# EAGLE design ValetudoV2 (EAGLE 9.6.2)
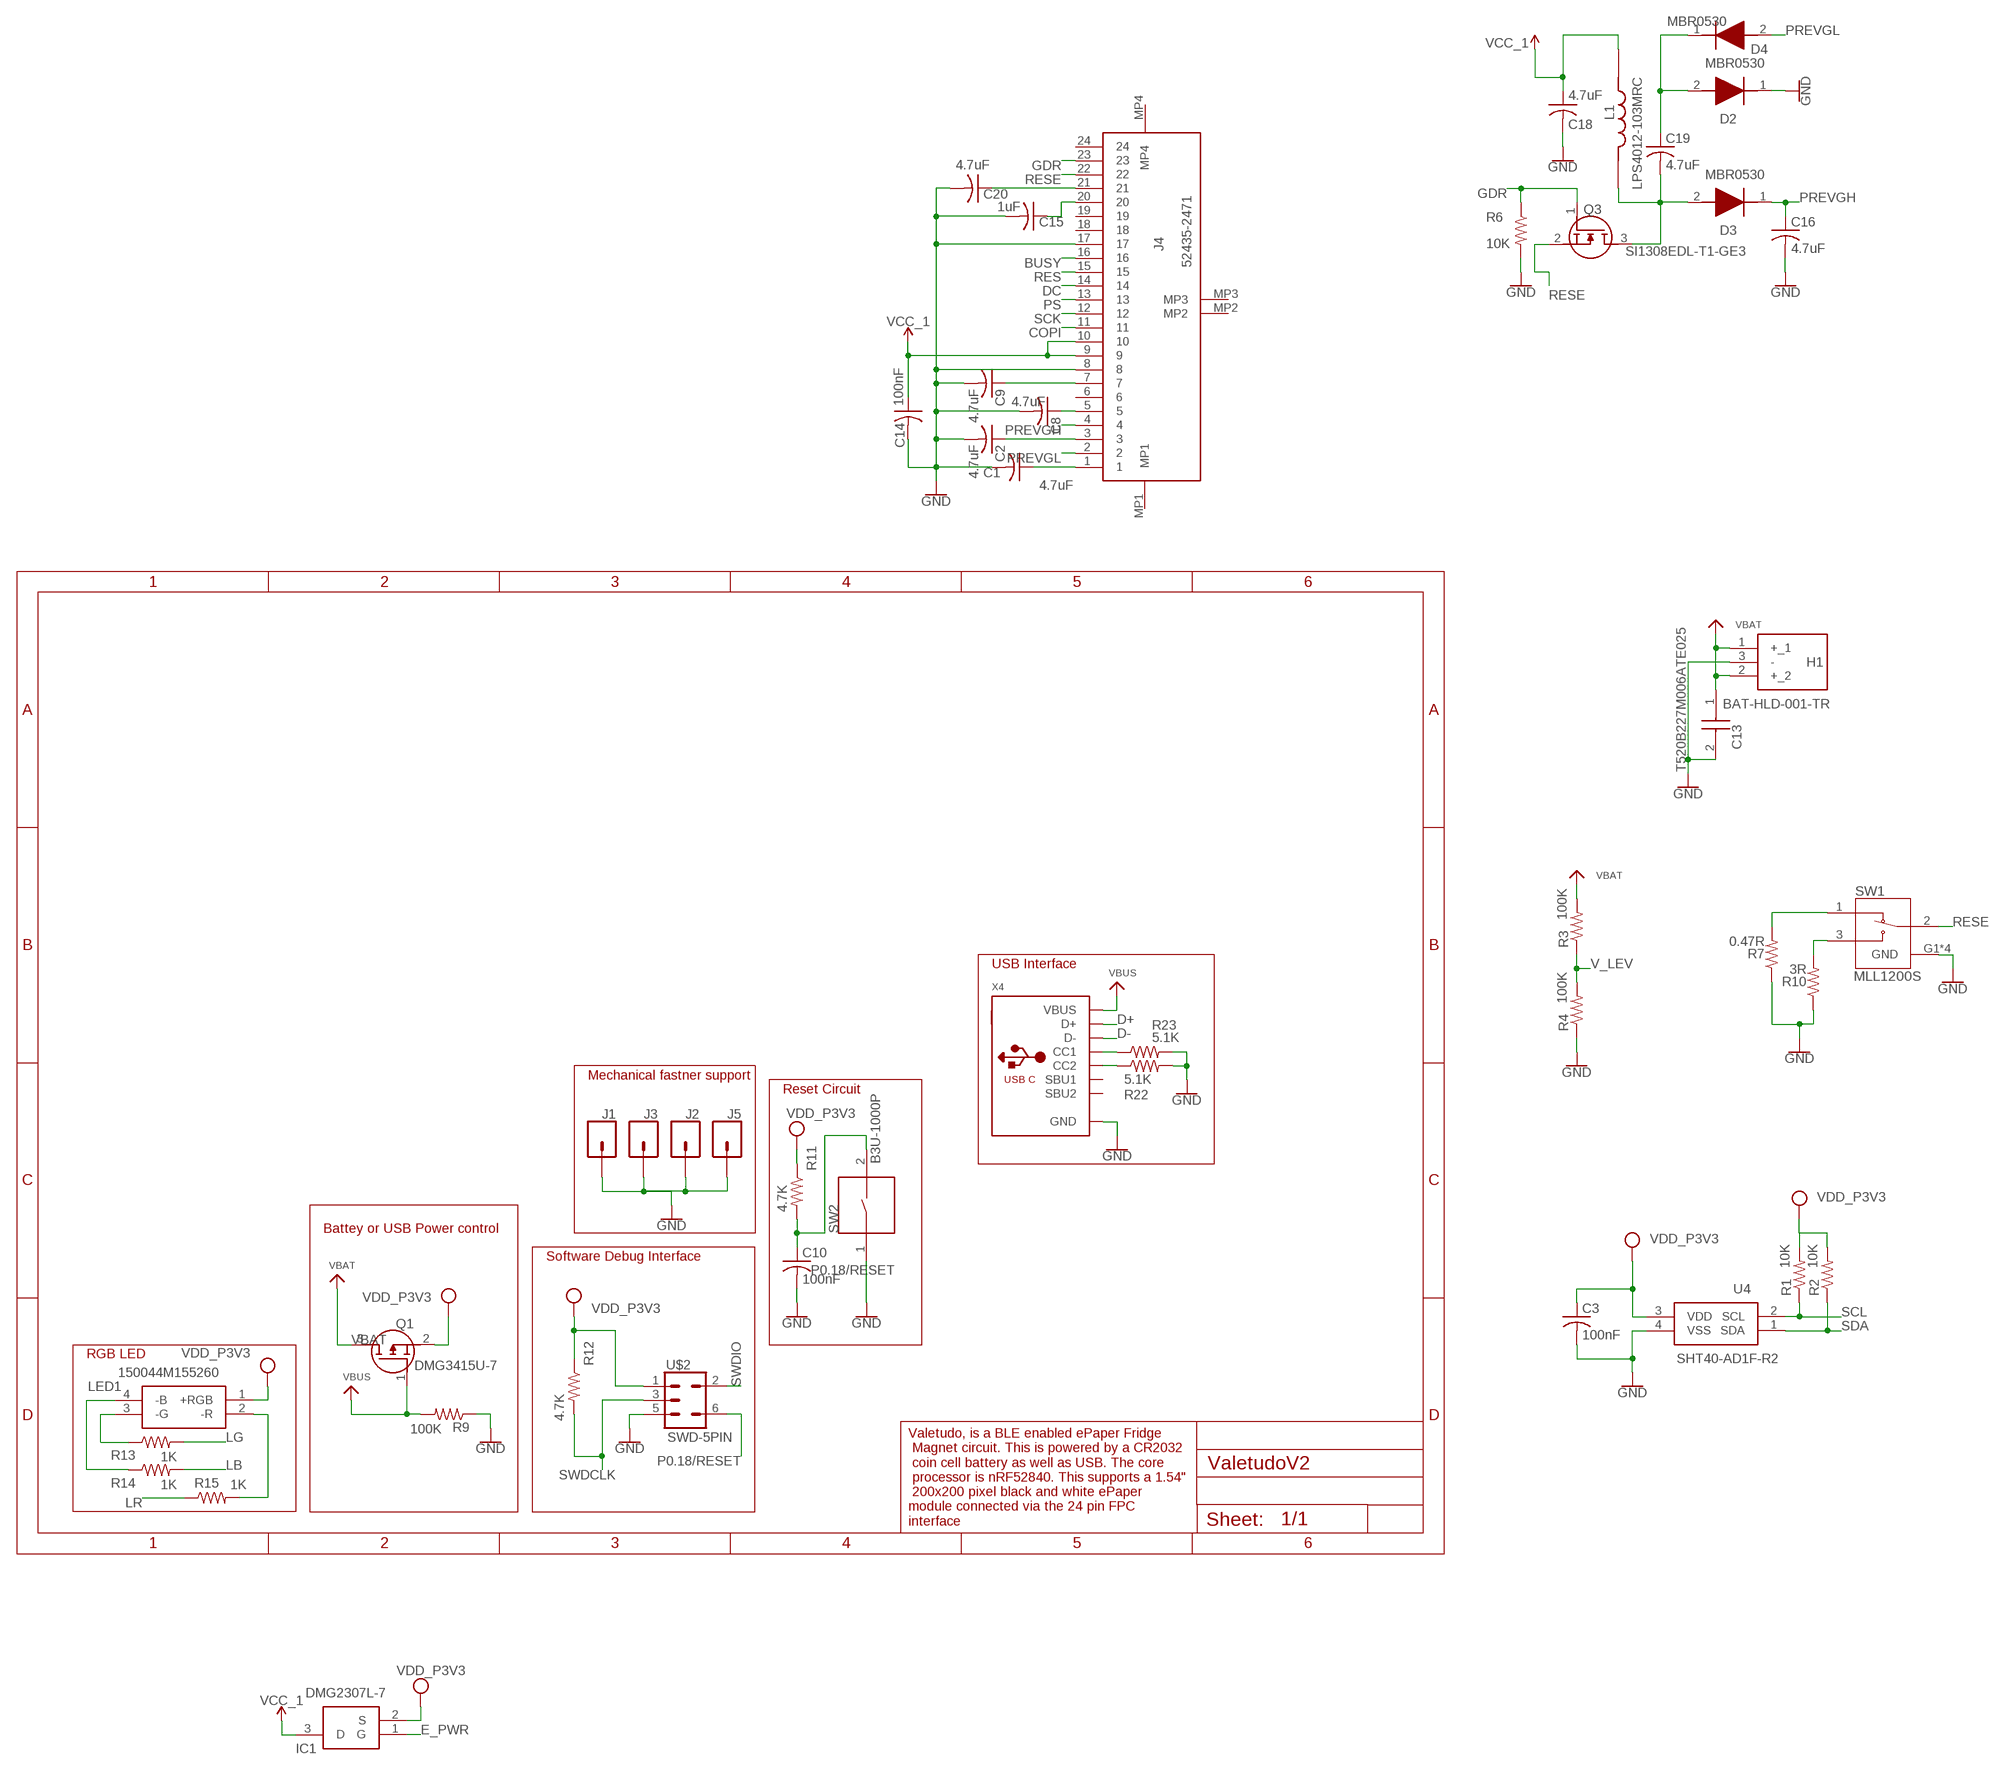
[diagram p0: schematic, sheet 1, part 1 of 2]
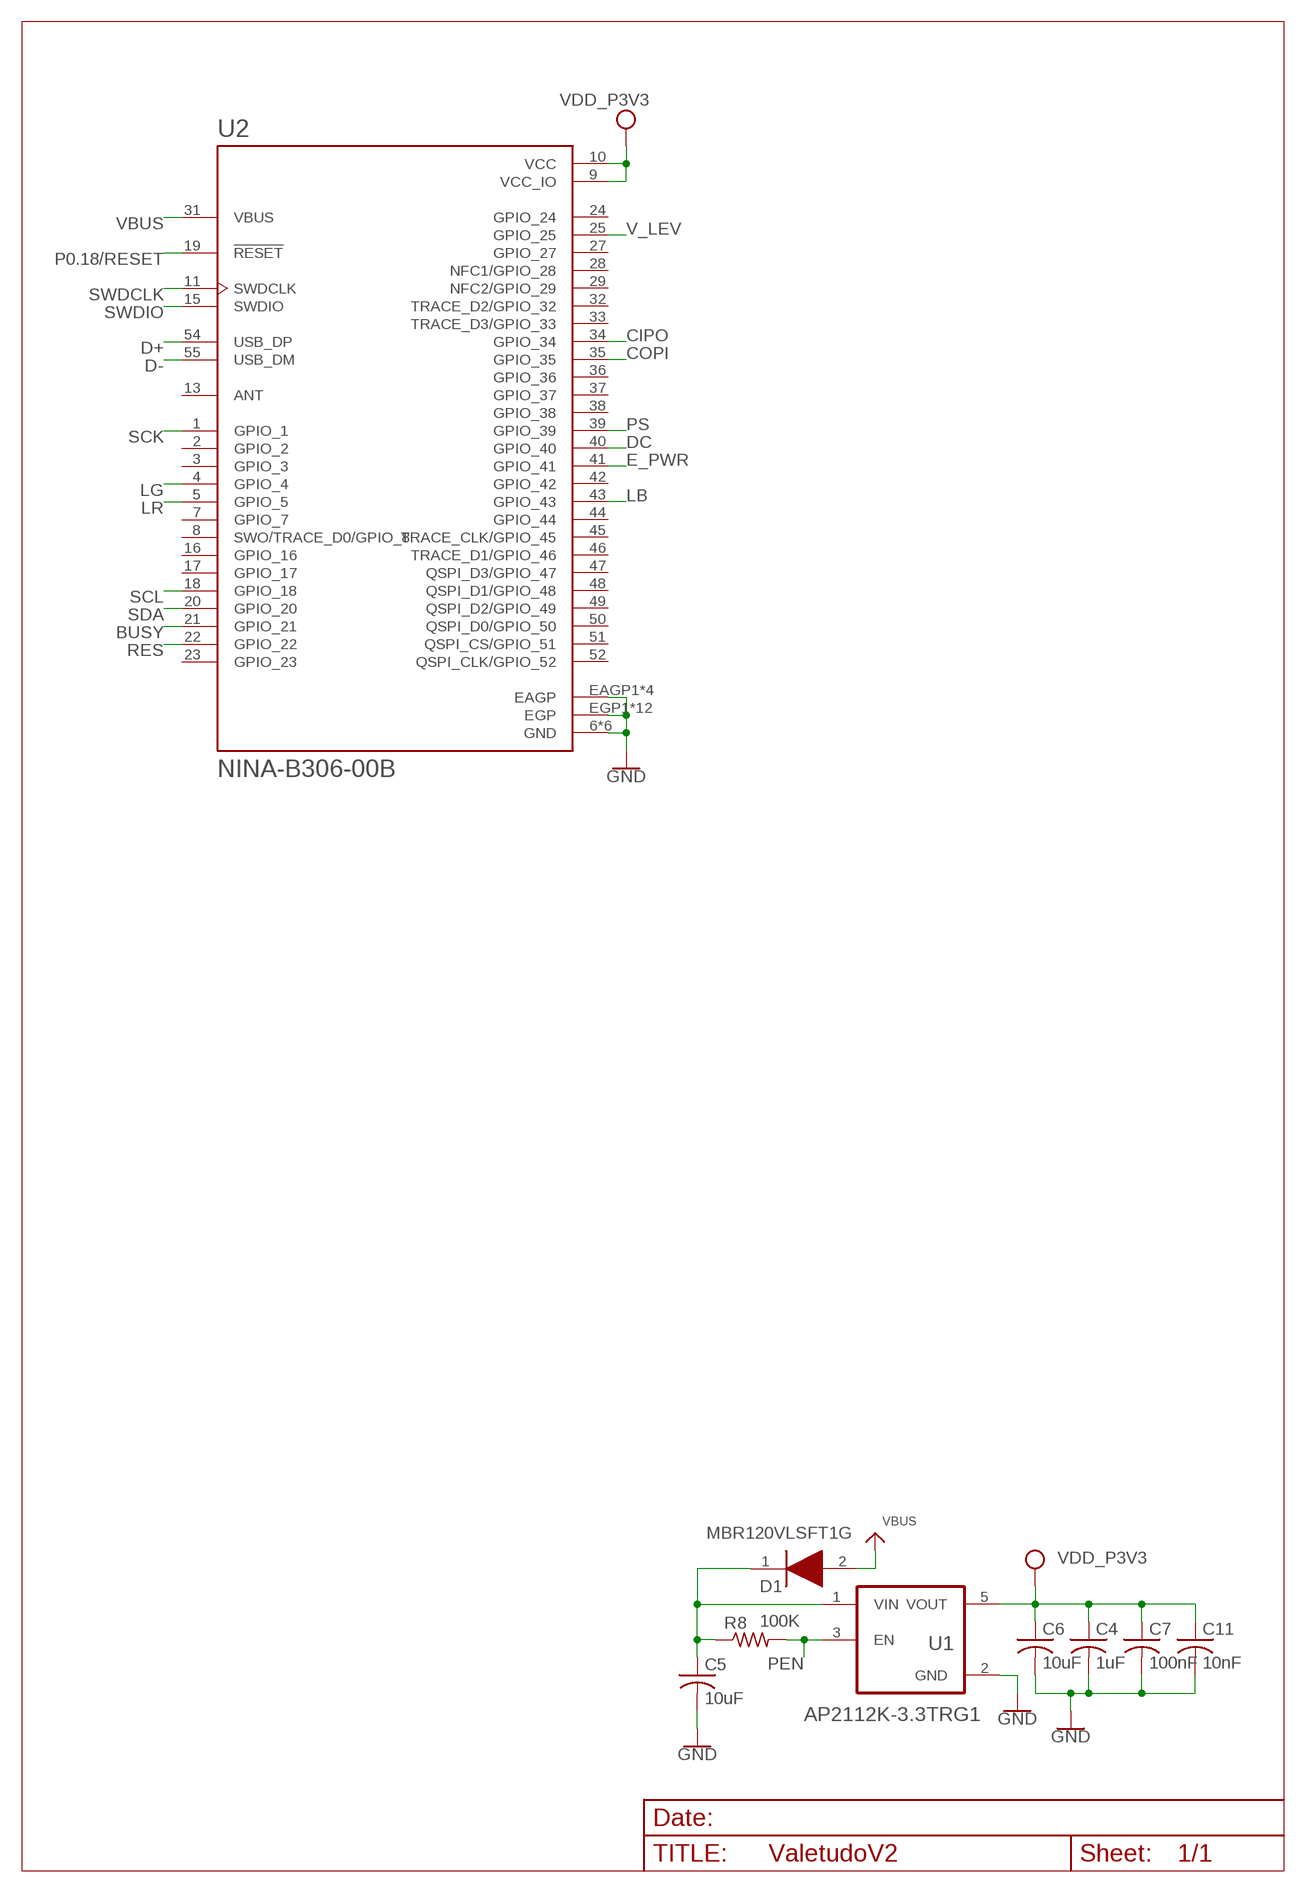
[diagram p1: schematic, sheet 1, part 2 of 2]

## Parts
C1  4.7uF  C-USC0402  [C0402]
C2  4.7uF  C-USC0402  [C0402]
C3  100nF  C-USC0402  [C0402]
C4  1uF  C-USC0402  [C0402]
C5  10uF  C-USC0402  [C0402]
C6  10uF  C-USC0402  [C0402]
C7  100nF  C-USC0402  [C0402]
C8  4.7uF  C-USC0402  [C0402]
C9  4.7uF  C-USC0402  [C0402]
C10  100nF  C-USC0402  [C0402]
C11  10nF  C-USC0402  [C0402]
C13  T520B227M006ATE025  [T520B]
C14  100nF  C-USC0402  [C0402]
C15  1uF  C-USC0402  [C0402]
C16  4.7uF  C-USC0402  [C0402]
C18  4.7uF  C-USC0402  [C0402]
C19  4.7uF  C-USC0402  [C0402]
C20  4.7uF  C-USC0402  [C0402]
D1  MBR120VLSFT1G  [SODFL3616X98N]
D2  MBR0530  [SOD3716X135N]
D3  MBR0530  [SOD3716X135N]
D4  MBR0530  [SOD3716X135N]
H1  BAT-HLD-001-TR  [BATHLD001TR]
IC1  DMG2307L-7  [SOT96P240X110-3N]
J1  CONN_01PTH_2MM  [1X01_2MM]
J2  CONN_01PTH_2MM  [1X01_2MM]
J3  CONN_01PTH_2MM  [1X01_2MM]
J4  52435-2471  [524352471]
J5  CONN_01PTH_2MM  [1X01_2MM]
L1  LPS4012-103MRC  [IND_LPS4012-103MRC]
LED1  150044M155260  [150044M155260]
Q1  DMG3415U-7  [SOT96P240X100-3N]
Q3  SI1308EDL-T1-GE3  [SOT65P210X110-3N]
R1  10K  R-US_R0402  [R0402]
R2  10K  R-US_R0402  [R0402]
R3  100K  R-US_R0402  [R0402]
R4  100K  R-US_R0402  [R0402]
R6  10K  R-US_R0402  [R0402]
R7  0.47R  R-US_R0402  [R0402]
R8  100K  R-US_R0402  [R0402]
R9  100K  R-US_R0402  [R0402]
R10  3R  R-US_R0402  [R0402]
R11  4.7K  R-US_R0402  [R0402]
R12  4.7K  R-US_R0402  [R0402]
R13  1K  R-US_R0402  [R0402]
R14  1K  R-US_R0402  [R0402]
R15  1K  R-US_R0402  [R0402]
R22  5.1K  R-US_R0402  [R0402]
R23  5.1K  R-US_R0402  [R0402]
SW1  MLL1200S  [SW_MLL1200S]
SW2  B3U-1000P  [SW_B3U-1000P]
U1  AP2112K-3.3TRG1  [SOT95P285X140-5N]
U2  NINA-B306-00B  [XCVR_NINA-B306-00B]
U4  SHT40-AD1F-R2  [SHT40AD1FR2]
U$2  SWD-5PIN  [PAD_05_03X2_TP_NO4]
X4  MICROBUILDER_USB_C  [MICROBUILDER_USB_C_CUSB31-CFM2AX-01-X]

## Nets
BUSY: J4.16 U2.21(GPIO_21)
CIPO: U2.34(GPIO_34)
COPI: J4.11 U2.35(GPIO_35)
D+: U2.54(USB_DP) X4.A6(D+) X4.B6(D+)
D-: U2.55(USB_DM) X4.A7(D-) X4.B7(D-)
DC: J4.14 U2.40(GPIO_40)
E_PWR: IC1.1(G) U2.41(GPIO_41)
GDR: J4.23 Q3.1(G) R6.1
GND: C1.2 C2.2 C3.2 C4.2 C5.2 C6.2 C7.2 C8.2 C9.2 C10.2 C11.2 C13.2(-) C14.2 C15.2 C16.2 C18.2 C20.2 D2.1(K) H1.3(-) J1.1 J2.1 J3.1 J4.8 J4.17 J5.1 R4.1 R6.2 R7.1 R9.1 R10.1 R22.2 R23.2 SW1.G1(GND) SW1.G2(GND) SW1.G3(GND) SW1.G4(GND) SW2.1 U1.2(GND) U2.6(GND) U2.12(GND) U2.14(GND) U2.26(GND) U2.30(GND) U2.53(GND) U2.EAGP1(EAGP) U2.EAGP2(EAGP) U2.EAGP3(EAGP) U2.EAGP4(EAGP) U2.EGP1(EGP) U2.EGP2(EGP) U2.EGP3(EGP) U2.EGP4(EGP) U2.EGP5(EGP) U2.EGP6(EGP) U2.EGP7(EGP) U2.EGP8(EGP) U2.EGP9(EGP) U2.EGP10(EGP) U2.EGP11(EGP) U2.EGP12(EGP) U4.4(VSS) U$2.5 X4.A1B12(GND) X4.B1A12(GND)
LB: R14.2 U2.43(GPIO_43)
LG: R13.2 U2.4(GPIO_4)
LR: R15.1 U2.5(GPIO_5)
N$1: LED1.4(-B) R14.1
N$2: LED1.3(-G) R13.1
N$3: LED1.2(-R) R15.2
N$4: R7.2 SW1.1
N$5: C1.1 J4.1
N$6: C19.1 D2.2(A) D4.1(K)
N$7: R22.1 X4.B5(CC2)
N$8: C2.1 J4.3
N$9: R23.1 X4.A5(CC1)
N$10: C5.1 D1.1(K) R8.1 U1.1(VIN)
N$11: C19.2 D3.2(A) L1.2 Q3.3(D)
N$12: C8.1 J4.5
N$13: R10.2 SW1.3
N$14: C9.1 J4.7
N$15: C15.1 J4.20
N$29: C20.1 J4.21
P0.18/RESET: C10.1 R11.2 SW2.2 U2.19(!RESET) U$2.6
PEN: R8.2 U1.3(EN)
PREVGH: C16.1 D3.1(K) J4.4
PREVGL: D4.2(A) J4.2
PS: J4.13 U2.39(GPIO_39)
RES: J4.15 U2.22(GPIO_22)
RESE: J4.22 Q3.2(S) SW1.2
SCK: J4.12 U2.1(GPIO_1)
SCL: R1.1 U2.18(GPIO_18) U4.2(SCL)
SDA: R2.1 U2.20(GPIO_20) U4.1(SDA)
SWDCLK: R12.2 U2.11(SWDCLK) U$2.3
SWDIO: U2.15(SWDIO) U$2.2
V_LEV: R3.1 R4.2 U2.25(GPIO_25)
VBAT: C13.1(+) H1.1(+_1) H1.2(+_2) Q1.3(D) R3.2
VBUS: D1.2(A) Q1.1(G) R9.2 U2.31(VBUS) X4.A4B9(VBUS) X4.B4A9(VBUS)
VCC: C3.1 C4.1 C6.1 C7.1 C11.1 IC1.2(S) LED1.1(+RGB) Q1.2(S) R1.2 R2.2 R11.1 R12.1 U1.5(VOUT) U2.9(VCC_IO) U2.10(VCC) U4.3(VDD) U$2.1 ; supply symbol labelled VDD_P3V3
VCC_1: C14.1 C18.1 IC1.3(D) J4.9 J4.10 L1.1
Unconnected: J4.6 J4.18 J4.19 J4.24 J4.MP1 J4.MP2 J4.MP3 J4.MP4 U2.2(GPIO_2) U2.3(GPIO_3) U2.7(GPIO_7) U2.8(SWO/TRACE_D0/GPIO_8) U2.13(ANT) U2.16(GPIO_16) U2.17(GPIO_17) U2.23(GPIO_23) U2.24(GPIO_24) U2.27(GPIO_27) U2.28(NFC1/GPIO_28) U2.29(NFC2/GPIO_29) U2.32(TRACE_D2/GPIO_32) U2.33(TRACE_D3/GPIO_33) U2.36(GPIO_36) U2.37(GPIO_37) U2.38(GPIO_38) U2.42(GPIO_42) U2.44(GPIO_44) U2.45(TRACE_CLK/GPIO_45) U2.46(TRACE_D1/GPIO_46) U2.47(QSPI_D3/GPIO_47) U2.48(QSPI_D1/GPIO_48) U2.49(QSPI_D2/GPIO_49) U2.50(QSPI_D0/GPIO_50) U2.51(QSPI_CS/GPIO_51) U2.52(QSPI_CLK/GPIO_52) X4.A8(SBU1) X4.B8(SBU2)

## Notes on the sheet
- USB Interface
- Mechanical fastner support
- Reset Circuit
- Battey or USB Power control
- Software Debug Interface
- RGB LED
- Valetudo, is a BLE enabled ePaper Fridge
   Magnet circuit. This is powered by a CR2032
   coin cell battery as well as USB. The core
   processor is nRF52840. This supports a 1.54"
   200x200 pixel black and white ePaper 
  module connected via the 24 pin FPC 
  interface

## Library data of the parts
C1-C11 C14-C16 C18-C20 = adafruit:C-US: CAPACITOR, American symbol
C13 = 220uF-Tantalum-T520B227M006ATE025:T520B227M006ATE025: T520, Tantalum, Polymer Tantalum, Commercial Grade, 220 uF, 20%, 6.3 VDC, 105C, -55C, 105C, SMD, Polymer, Molded, Low ESR, Non-Combustible, 2,000 Hrs, 8 % , 25 mOhms, 138.6 uA, 94.85 mg, 3528, 1.9mm, Height Max = 2mm, 2000, 52 Weeks Source: Datasheet; ARROW_PART_NUMBER: T520B227M006ATE025; ARROW_PRICE-STOCK: https://www.arrow.com/en/products/t520b227m006ate025/kemet-corporation; DESCRIPTION: T520, Tantalum, Polymer Tantalum, Commercial Grade, 220 uF, 20%, 6.3 VDC, 105C, -55C, 105C, SMD, Polymer, Molded, Low ESR, Non-Combustible, 2,000 Hrs, 8 % , 25 mOhms, 138.6 uA, 94.85 mg, 3528, 1.9mm, Height Max = 2mm, 2000, 52 Weeks; HEIGHT: 2mm; MANUFACTURER_NAME: KEMET; MANUFACTURER_PART_NUMBER: T520B227M006ATE025; MOUSER_PART_NUMBER: 80-T520B227M006ATE25; MOUSER_PRICE-STOCK: https://www.mouser.co.uk/ProductDetail/KEMET/T520B227M006ATE025?qs=eUQWkpNJpk2sccLXhrmiDw%3D%3D
D1 = MBR120VLSFT1G:MBR120VLSFT1G: Diode Schottky 20V 1A SOD123FL ON Semi MBR120VLSFT1G, SMT Schottky Diode, 20V 1A, 2-Pin SOD-123FL Source: Datasheet; DESCRIPTION: Diode Schottky 20V 1A SOD123FL ON Semi MBR120VLSFT1G, SMT Schottky Diode, 20V 1A, 2-Pin SOD-123FL; HEIGHT: 0.98mm; MANUFACTURER_NAME: ON Semiconductor; MANUFACTURER_PART_NUMBER: MBR120VLSFT1G; MOUSER_PART_NUMBER: 863-MBR120VLSFT1G; MOUSER_PRICE-STOCK: https://www.mouser.co.uk/ProductDetail/ON-Semiconductor/MBR120VLSFT1G?qs=3JMERSakebpX%252BkItPpFCkg%3D%3D
D2-D4 = MBR0530:MBR0530: Compact Surface Mount Package with The Same Footprint as Mini-melf; Schottky Rectifier, 0.5A, 30V in SOD-123 Package Source: Datasheet; ARROW_PART_NUMBER: MBR0530; ARROW_PRICE-STOCK: https://www.arrow.com/en/products/mbr0530/on-semiconductor?region=nac; DESCRIPTION: Compact Surface Mount Package with The Same Footprint as Mini-melf; Schottky Rectifier, 0.5A, 30V in SOD-123 Package; HEIGHT: 1.35mm; MANUFACTURER_NAME: onsemi; MANUFACTURER_PART_NUMBER: MBR0530; MOUSER_PART_NUMBER: 512-MBR0530; MOUSER_PRICE-STOCK: https://www.mouser.co.uk/ProductDetail/onsemi-Fairchild/MBR0530?qs=VOMQJJE%252BBNniwJKcE3T43Q%3D%3D
H1 = BAT-HLD-001-TR:BAT-HLD-001-TR: Battery Holders, CR2032, 1 Position, Horizontal, Nickel, PCB Mount Alignment, Power, -40 257 F [-40 125 C] Source: Datasheet; ARROW_PART_NUMBER: BAT-HLD-001-TR; ARROW_PRICE-STOCK: https://www.arrow.com/en/products/bat-hld-001-tr/te-connectivity?utm_currency=USD&region=nac; DESCRIPTION: Battery Holders, CR2032, 1 Position, Horizontal, Nickel, PCB Mount Alignment, Power, -40 257 F [-40 125 C]; HEIGHT: 4.4mm; MANUFACTURER_NAME: TE Connectivity; MANUFACTURER_PART_NUMBER: BAT-HLD-001-TR; MOUSER_PART_NUMBER: 712-BAT-HLD-001-TR; MOUSER_PRICE-STOCK: https://www.mouser.co.uk/ProductDetail/TE-Connectivity-Linx-Technologies/BAT-HLD-001-TR?qs=K5ta8V%252BWhtZh3MyWmkkmjQ%3D%3D
IC1 = DMG2307L-7:DMG2307L-7: Lattice Source: Datasheet; DESCRIPTION: Lattice; HEIGHT: 1.1mm; MANUFACTURER_NAME: Lattice Semiconductor; MANUFACTURER_PART_NUMBER: DMG2307L-7; MOUSER_PART_NUMBER: N/A; MOUSER_PRICE-STOCK: https://www.mouser.com/Search/Refine.aspx?Keyword=N%2FA
J1-J3 J5 = SparkFun-Connectors:CONN_01: Single connection point. Often used as Generic Header-pin footprint for 0.1 inch spaced/style header connections On any of the 0.1 inch spaced packages, you can populate with these: Break Away Headers - Straight (PRT-00116) Break Away Male Headers - Right Angle (PRT-00553) Female Headers (PRT-00115) Break Away Headers - Machine Pin (PRT-00117) Break Away Female Headers - Swiss Machine Pin (PRT-00743) This device is also useful as a general connection point to wire up your design to another part of your project. Our various solder wires solder well into these plated through hole pads. Hook-Up Wire - Assortment (Stranded, 22 AWG) (PRT-11375) Hook-Up Wire - Assortment (Solid Core, 22 AWG) (PRT-11367) View the entire wire category on our website here Special notes: SMTSO-256-ET is a "flush mount" nut for a 4-40 screw. We mostly use this on specialty testbeds; it is a nice way to connect hardware to your PCB at an adjustable hieght. Also note, the SNAP packages are for using a snappable style connector. We sell a baggie of snaps and they are also used on two LilyPad designs: Snap Assortment - 30 pack (male and female) (DEV-11347) LilyPad Arduino SimpleSnap (DEV-10941) LilyPad SimpleSnap Protoboard (DEV-10940)
J4 = 52435-2471:52435-2471: Molex 52435 Series 0.5mm Pitch 24 Way 1 Row Right Angle FPC Connector, Gold Plated Contacts Source: Datasheet; DESCRIPTION: Molex 52435 Series 0.5mm Pitch 24 Way 1 Row Right Angle FPC Connector, Gold Plated Contacts; HEIGHT: 2.2mm; MANUFACTURER_NAME: Molex; MANUFACTURER_PART_NUMBER: 52435-2471; MOUSER_PART_NUMBER: 538-52435-2471; MOUSER_PRICE-STOCK: https://www.mouser.co.uk/ProductDetail/Molex/52435-2471?qs=uvlUoL4n1XCacQpF%2FFZzTg%3D%3D
L1 = LPS4012-103MRC:LPS4012-103MRC: Check availability; AVAILABILITY: In Stock; CHECK_PRICES: https://www.snapeda.com/parts/LPS4012-103MRC/Coilcraft/view-part/?ref=eda; DESCRIPTION: Power inductor, shielded, 20/30% tol, SMT, RoHS, lead-free, halogen-free; MF: Coilcraft; MP: LPS4012-103MRC; PACKAGE: Package; PRICE: None; SNAPEDA_LINK: https://www.snapeda.com/parts/LPS4012-103MRC/Coilcraft/view-part/?ref=snap
LED1 = Wurth-RGB-150044M155260:150044M155260: 2.4 V, 3.1 V, 3.3 V RGB LED 1010 (0404) SMD, Wurth Elektronik WL-SFCC 150044M155260 Source: Datasheet; DESCRIPTION: 2.4 V, 3.1 V, 3.3 V RGB LED 1010 (0404) SMD, Wurth Elektronik WL-SFCC 150044M155260; HEIGHT: 0.75mm; MANUFACTURER_NAME: Wurth Elektronik; MANUFACTURER_PART_NUMBER: 150044M155260; MOUSER_PART_NUMBER: 710-150044M155260; MOUSER_PRICE-STOCK: https://www.mouser.co.uk/ProductDetail/Wurth-Elektronik/150044M155260?qs=u16ybLDytRba39Og9E2ywA%3D%3D
Q1 = DMG3415U-7:DMG3415U-7: P-CHANNEL ENHANCEMENT MODE MOSFET Source: Datasheet; DESCRIPTION: P-CHANNEL ENHANCEMENT MODE MOSFET; HEIGHT: 1mm; LCSC_PART_NUMBER: C96616; LCSC_PRICE-STOCK: https://lcsc.com/product-detail/MOSFET_Diodes-Incorporated_DMG3415U-7_Diodes-Incorporated-DMG3415U-7_C96616.html; MANUFACTURER_NAME: Diodes Inc.; MANUFACTURER_PART_NUMBER: DMG3415U-7
Q3 = Si1308EDL-T1-GE3:SI1308EDL-T1-GE3: MOSFET N-Ch 30V 1.5A TrenchFET SC70 Vishay Si1308EDL-T1-GE3 N-channel MOSFET Transistor, 1.5 A, 30 V, 3-Pin SC-70 Source: Datasheet; ARROW_PART_NUMBER: SI1308EDL-T1-GE3; ARROW_PRICE-STOCK: https://www.arrow.com/en/products/si1308edl-t1-ge3/vishay?utm_currency=USD&region=nac; DESCRIPTION: MOSFET N-Ch 30V 1.5A TrenchFET SC70 Vishay Si1308EDL-T1-GE3 N-channel MOSFET Transistor, 1.5 A, 30 V, 3-Pin SC-70; HEIGHT: 1.1mm; MANUFACTURER_NAME: Vishay; MANUFACTURER_PART_NUMBER: Si1308EDL-T1-GE3; MOUSER_PART_NUMBER: 78-SI1308EDL-T1-GE3; MOUSER_PRICE-STOCK: https://www.mouser.co.uk/ProductDetail/Vishay-Semiconductors/SI1308EDL-T1-GE3?qs=bX1%252BNvsK%2FBramh9tgpOaEw%3D%3D
R1-R4 R6-R15 R22 R23 = adafruit:R-US_: RESISTOR, American symbol
SW1 = MLL1200S:MLL1200S: Switch Slide SPDT Side Slide 0.3A 4VDC Gull Wing SMD Box Check prices; AVAILABILITY: In Stock; COMMENT: 1437575-1; DESCRIPTION: Slide Switch SPDT Surface Mount, Right Angle; MF: TE Connectivity; MP: MLL1200S; PACKAGE: None; PRICE: None; PURCHASE-URL: https://pricing.snapeda.com/search/part/MLL1200S/?ref=eda
SW2 = B3U-1000P:B3U-1000P: Switch Tactile N.O. SPST Round Button Gull Wing 0.05A 12VDC 1.5N SMD Embossed T/R; AVAILABILITY: Unavailable; DESCRIPTION: Switch Tactile N.O. SPST Round Button Gull Wing 0.05A 12VDC 1.5N SMD Embossed T/R; MF: Omron; MP: B3U-1000P; PACKAGE: None; PRICE: None
U1 = AP2112K-3.3TRG1:AP2112K-3.3TRG1: AP2112 Series 0.6 A 3.3 V Fixed Output SMT LDO Linear Regulator - SOT23-5; AVAILABILITY: Unavailable; DESCRIPTION: AP2112 Series 0.6 A 3.3 V Fixed Output SMT LDO Linear Regulator - SOT23-5; MF: Diodes Inc.; MP: AP2112K-3.3TRG1; PACKAGE: SOT-753 Diodes Inc.; PRICE: None
U2 = NINA-B306-00B:NINA-B306-00B: With internal PCB antenna, 10.0 x 15.0 x 2.2 mm, use with open CPU Check availability; AVAILABILITY: In Stock; CHECK_PRICES: https://www.snapeda.com/parts/NINA-B306-00B/u-blox/view-part/?ref=eda; DESCRIPTION: Bluetooth Bluetooth v5.0 Transceiver Module 2.4GHz Integrated, Trace Surface Mount; MF: U-Blox; MP: NINA-B306-00B; PACKAGE: SMD-55 U-Blox; PRICE: None; PURCHASE-URL: https://www.snapeda.com/api/url_track_click_mouser/?unipart_id=4800389&manufacturer=U-Blox&part_name=NINA-B306-00B&search_term=nina-b306-00b; SNAPEDA_LINK: https://www.snapeda.com/parts/NINA-B306-00B/u-blox/view-part/?ref=snap
U4 = SHT40-AD1F-R2:SHT40-AD1F-R2: Board Mount Humidity Sensors Digital Humidity and Temperature Sensor incl Filter Membrane Source: Datasheet; ARROW_PART_NUMBER: SHT40-AD1F-R2; ARROW_PRICE-STOCK: https://www.arrow.com/en/products/sht40-ad1f-r2/sensirion-ag?region=nac; DESCRIPTION: Board Mount Humidity Sensors Digital Humidity and Temperature Sensor incl Filter Membrane; HEIGHT: 0.59mm; MANUFACTURER_NAME: Sensirion; MANUFACTURER_PART_NUMBER: SHT40-AD1F-R2; MOUSER_PART_NUMBER: 403-SHT40-AD1F-R2; MOUSER_PRICE-STOCK: https://www.mouser.co.uk/ProductDetail/Sensirion/SHT40-AD1F-R2?qs=rQFj71Wb1eVPr6MxV5k7AQ%3D%3D
U$2 = SparkFun-Connectors:SWD-5PIN: 5-pin SWD connector Test-point based header for SWD. Pin 1 - PWR Pin 2 - SWDIO Pin 3 - SWCLK Pin 4 - NC Pin 5 - GND Pin 6 - RESET
X4 = Adafruit Feather STM32F405 Express:MICROBUILDER_USB_C: USB Type-C USB 2.0 Connector

## Board
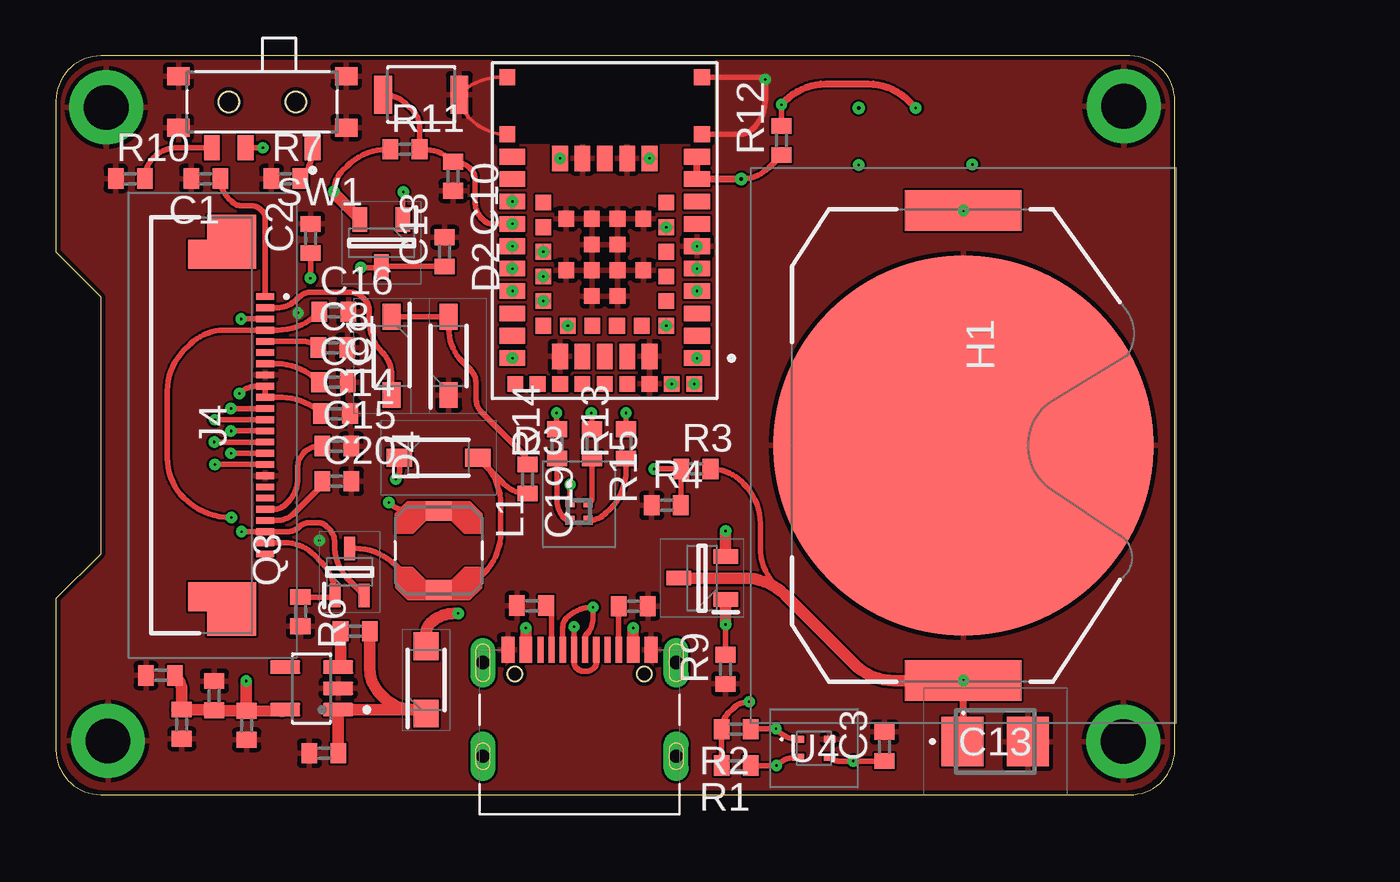
[diagram p2: board, top side]
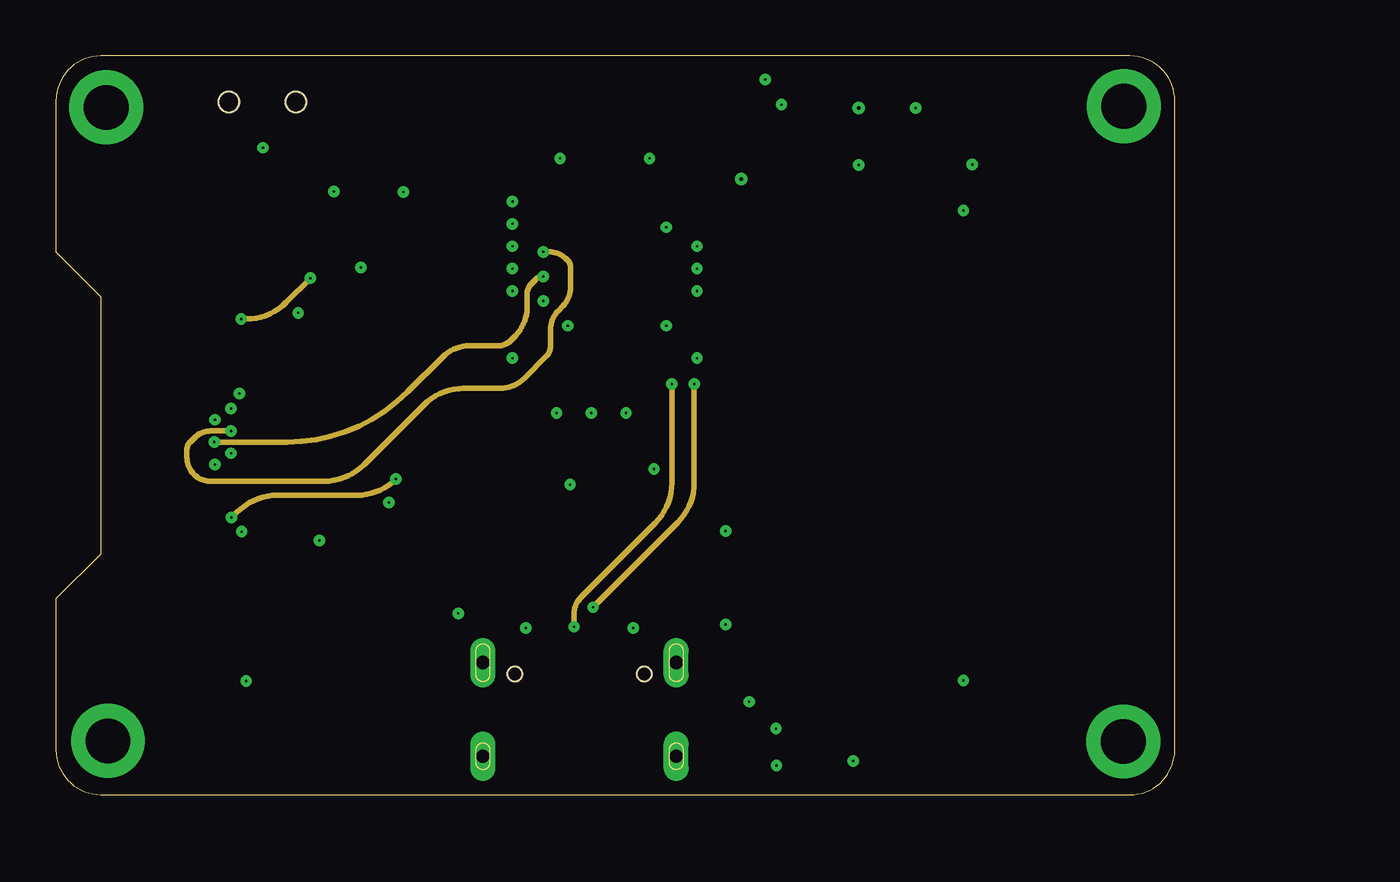
[diagram p3: board, inner layer Route2]
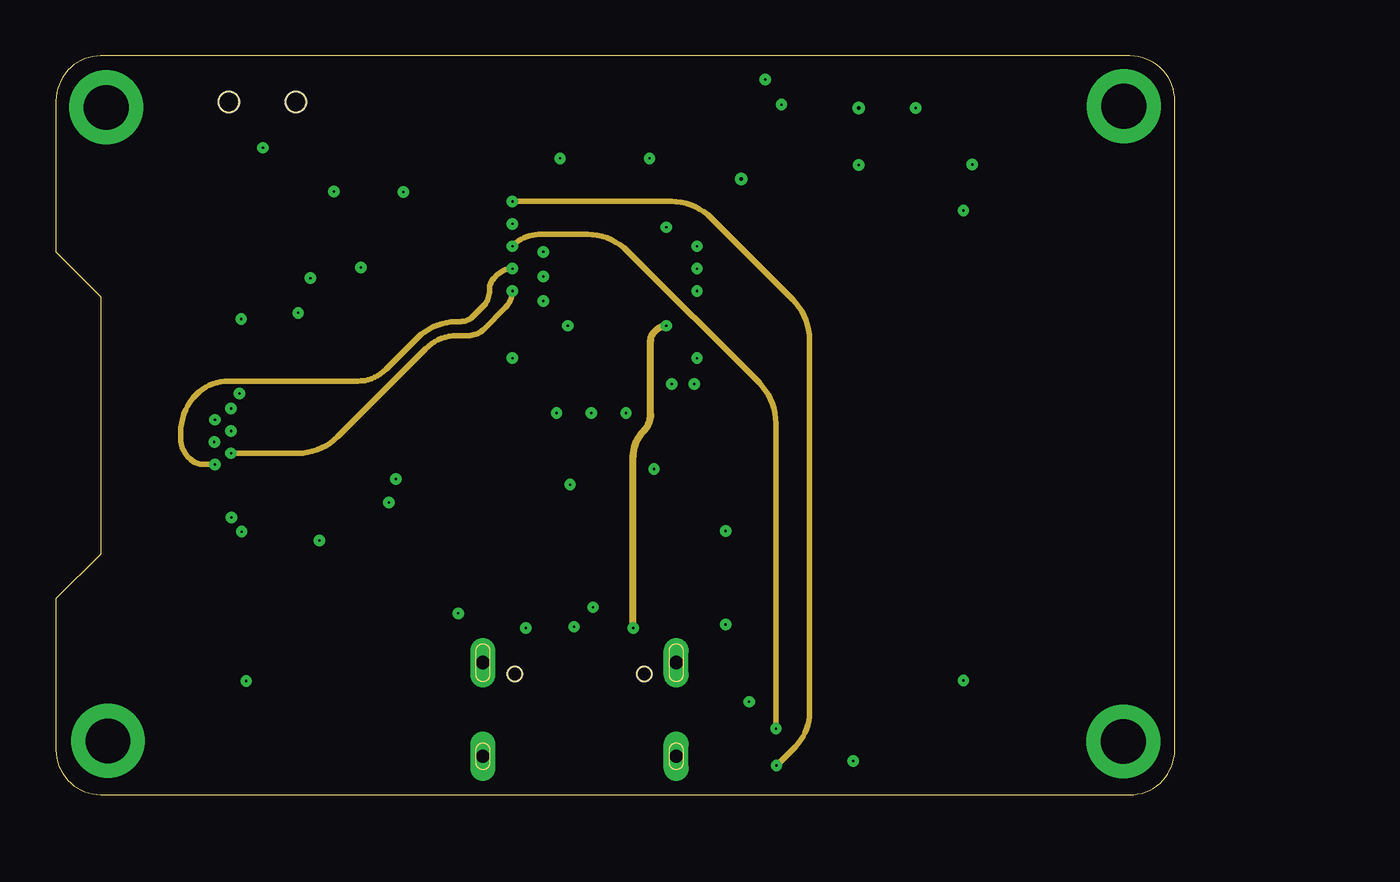
[diagram p4: board, inner layer Route3]
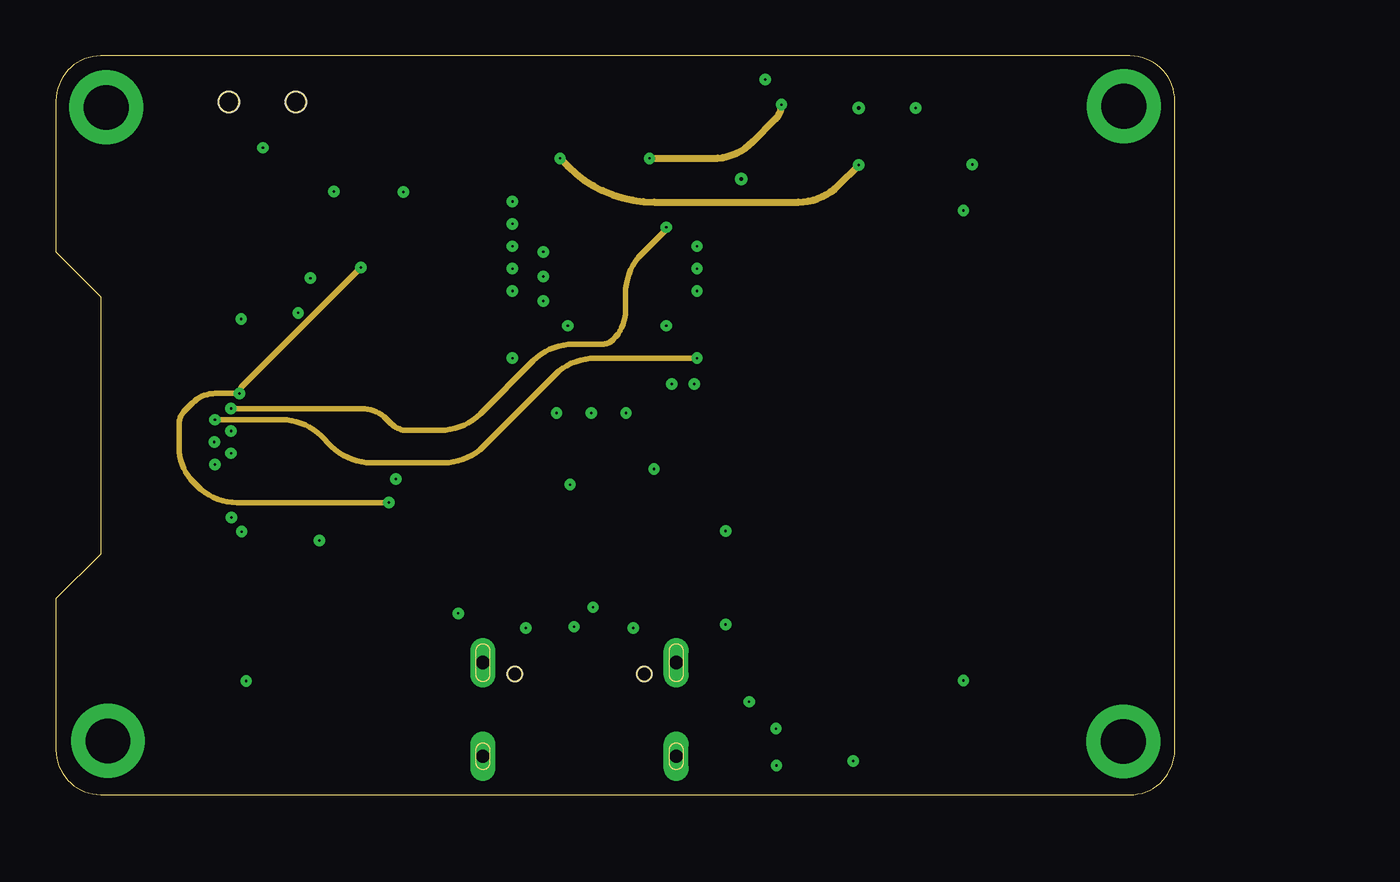
[diagram p5: board, inner layer Route14]
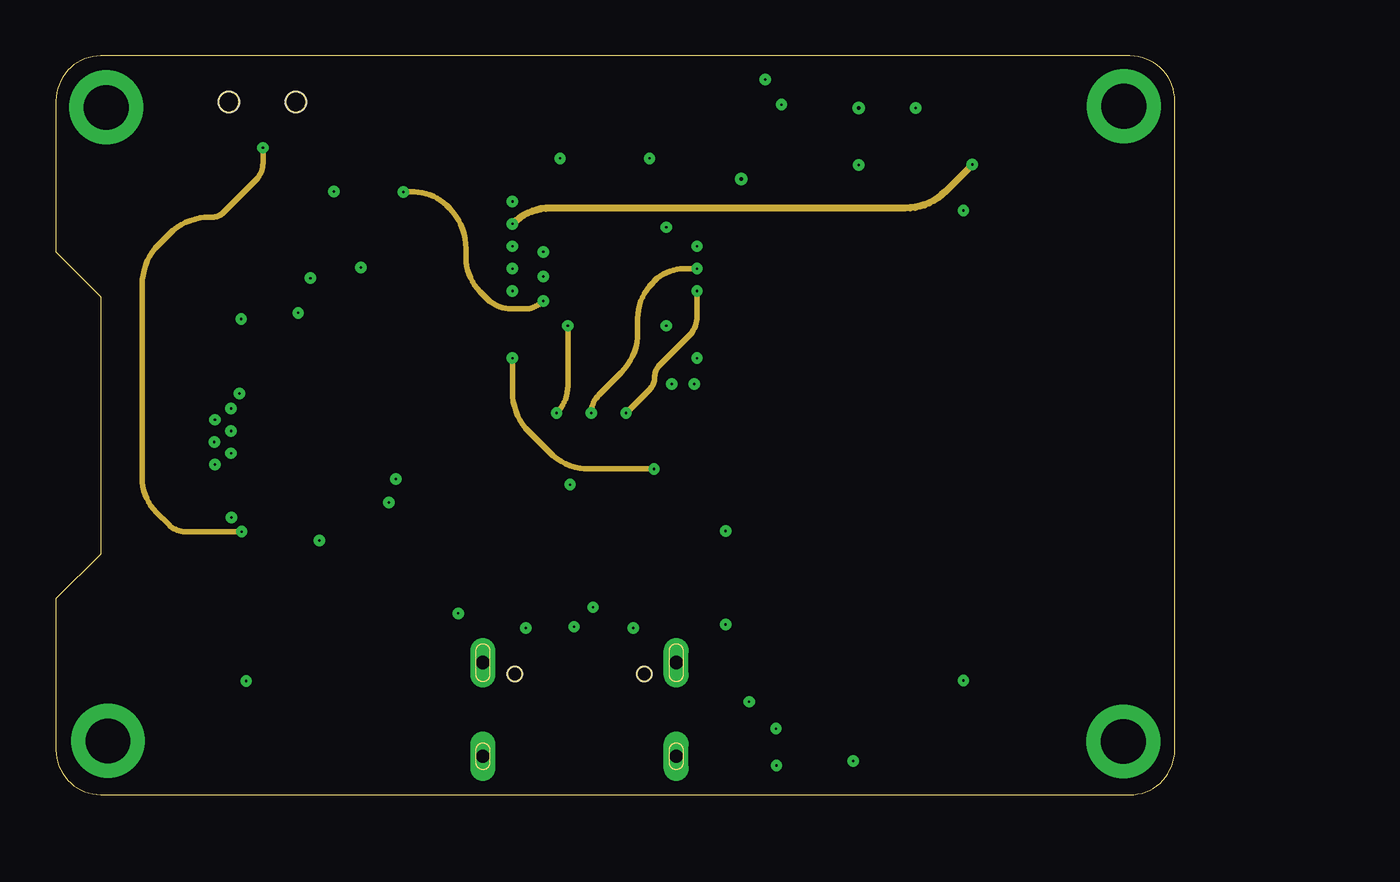
[diagram p6: board, inner layer Route15]
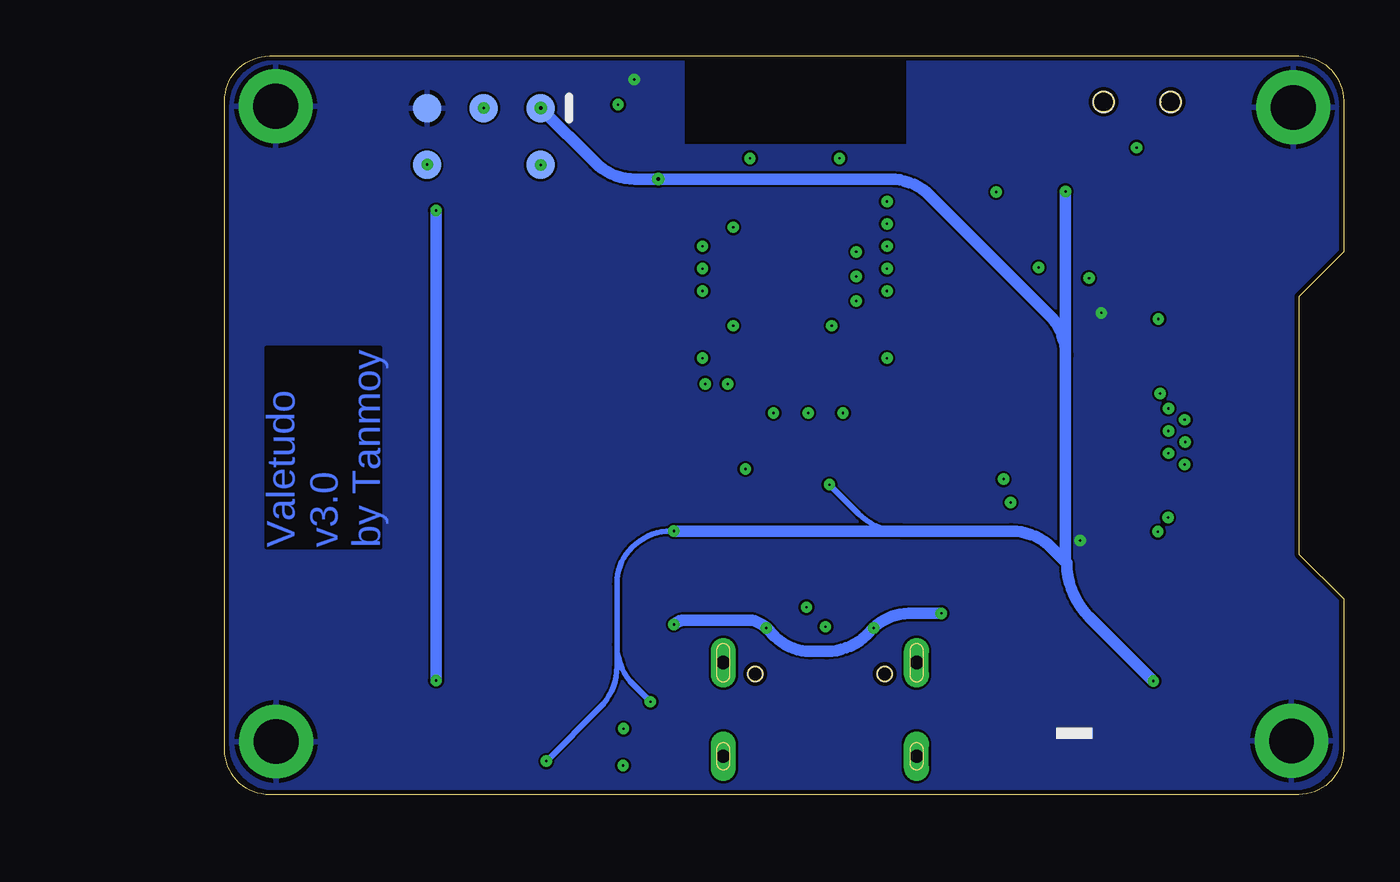
[diagram p7: board, bottom side, seen from below]

Size 50 x 33 mm. Coordinates in mm from the lower left corner, seen from the top.
Outline: 327 segments
Copper layers ((1+2)*3+14*15+16): Top 0.035mm / dielectric 0.2mm / Route2 0.035mm / dielectric 0.64mm / Route3 0.035mm / dielectric 0.2mm / Route14 0.035mm / dielectric 0.15mm / Route15 0.035mm / dielectric 0.2mm / Bottom 0.035mm
Design rules "Nordic *": minimum track width 0.1mm, minimum drill 0.15mm, track to track 0.1mm, track to pad 0.1mm, pad to pad 0.1mm, via to via 0.1mm, smd to smd 0.1mm, copper to edge 0.2mm, drill to drill 0.2mm, minimum pad ring 10mil, minimum via ring 8mil, stop-mask expansion 4mil, vias tented up to drill 0mil, thermal gap 0.2mm
Holes 0.65 mm at 26.29,5.39 20.51,5.39
Holes 0.9 mm at 10.72,30.95 7.72,30.95

### Footprints (pad centres in the part's own frame; a part is rotated, then mirrored left to right if it is on the bottom)
C0402 = smd 0.7 x 0.9: 1 -0.65,0; 2 0.65,0
T520B = smd 1.87 x 2.23: 1 -1.46,0; 2 1.46,0
SODFL3616X98N = smd 1.24 x 1.12: 1 -1.5,0; 2 1.5,0
SOD3716X135N = smd 1.15 x 0.8: 1 -1.75,0; 2 1.75,0
BATHLD001TR = smd 1.8 x 5.2: 1 -10.5,0; 2 10.5,0 | smd 17 x 17: 3 0,0
SOT96P240X110-3N = smd 1.1 x 0.65: 1 -1.05,0.96; 2 -1.05,-0.96; 3 1.05,0
1X01_2MM = drill 2 pad 3.302: 1 0,0
524352471 = smd 0.3 x 0.8: 1 -5.75,2.85; 2 -5.25,2.85; 3 -4.75,2.85; 4 -4.25,2.85; 5 -3.75,2.85; 6 -3.25,2.85; 7 -2.75,2.85; 8 -2.25,2.85; 9 -1.75,2.85; 10 -1.25,2.85; 11 -0.75,2.85; 12 -0.25,2.85; 13 0.25,2.85; 14 0.75,2.85; 15 1.25,2.85; 16 1.75,2.85; 17 2.25,2.85; 18 2.75,2.85; 19 3.25,2.85; 20 3.75,2.85; 21 4.25,2.85; 22 4.75,2.85; 23 5.25,2.85; 24 5.75,2.85 | smd 1.1 x 2.2: MP1 -8.85,1.35; MP4 8.85,1.35 | smd 1.3 x 3.05: MP2 -7.65,0.925; MP3 7.65,0.925
IND_LPS4012-103MRC = smd 0.87 x 1.15: 1 -1.765,0; 2 1.765,0
150044M155260 = smd 0.4 x 0.4: 1 -0.4,-0.4; 2 -0.4,0.4; 3 0.4,0.4; 4 0.4,-0.4
SOT96P240X100-3N = smd 1.1 x 0.65: 1 -1.05,0.96; 2 -1.05,-0.96; 3 1.05,0
SOT65P210X110-3N = smd 1.05 x 0.5: 1 -1.05,0.65; 2 -1.05,-0.65; 3 1.05,0
R0402 = smd 0.7 x 0.9: 1 -0.65,0; 2 0.65,0
SW_MLL1200S = smd 0.7 x 1.1: 1 -2.25,2.05; 2 0.75,2.05; 3 2.25,2.05 | smd 1 x 0.8: G1 -3.75,1.15; G2 3.75,1.15; G3 -3.75,-1.15; G4 3.75,-1.15 | hole 0.9: -1.5,0; 1.5,0
SW_B3U-1000P = smd 0.8 x 1.7: 1 -1.7,0; 2 1.7,0
SOT95P285X140-5N = smd 1.35 x 0.6: 1 -1.185,0.95; 2 -1.185,0; 3 -1.185,-0.95; 4 1.185,-0.95; 5 1.185,0.95
XCVR_NINA-B306-00B = smd 1.15 x 0.7: 1 -4.125,5.7; 2 -4.125,4.7; 3 -4.125,3.7; 4 -4.125,2.7; 5 -4.125,1.7; 6 -4.125,0.7; 7 -4.125,-0.3; 8 -4.125,-1.3; 9 -4.125,-2.3; 10 -4.125,-3.3; 16 4.125,-3.3; 17 4.125,-2.3; 18 4.125,-1.3; 19 4.125,-0.3; 20 4.125,0.7; 21 4.125,1.7; 22 4.125,2.7; 23 4.125,3.7; 24 4.125,4.7; 25 4.125,5.7 | smd 0.7 x 1.15: 11 -2,-3.225; 12 -1,-3.225; 13 0,-3.225; 14 1,-3.225; 15 2,-3.225; 26 2,5.625; 27 1,5.625; 28 0,5.625; 29 -1,5.625; 30 -2,5.625 | smd 0.7 x 0.7: 31 -2.75,4.25; 32 -2.75,3.15; 33 -2.75,2.05; 34 -2.75,0.95; 35 -2.75,-0.15; 36 -2.75,-1.25; 37 2.75,-1.25; 38 2.75,-0.15; 39 2.75,0.95; 40 2.75,2.05; 41 2.75,3.15; 42 2.75,4.25; 43 1.65,4.25; 44 0.55,4.25; 45 -0.55,4.25; 46 -1.65,4.25; 47 4,6.85; 48 3,6.85; 49 2,6.85; 50 1,6.85; 51 0,6.85; 52 -1,6.85; 53 -2,6.85; 54 -3,6.85; 55 -4,6.85; EAGP1 -4.35,-4.3; EAGP2 4.35,-4.3; EAGP3 -4.35,-6.85; EAGP4 4.35,-6.85; EGP1 -0.575,2.925; EGP2 0.575,2.925; EGP3 -1.725,1.775; EGP4 -0.575,1.775; EGP5 0.575,1.775; EGP6 1.725,1.775; EGP7 -0.575,0.625; EGP8 0.575,0.625; EGP9 -1.725,-0.525; EGP10 -0.575,-0.525; EGP11 0.575,-0.525; EGP12 1.725,-0.525
SHT40AD1FR2 = smd 0.5 x 0.3: 1 -0.7,0.4; 2 -0.7,-0.4; 3 0.7,-0.4; 4 0.7,0.4
PAD_05_03X2_TP_NO4 = smd 1.27 x 1.27: 1 -2.54,-1.27; 2 -2.54,1.27; 3 0,-1.27; 5 2.54,-1.27; 6 2.54,1.27
MICROBUILDER_USB_C_CUSB31-CFM2AX-01-X = smd 0.575 x 1.15: A1B12 -3.2,3.545; A4B9 -2.4,3.545; B1A12 3.2,3.545; B4A9 2.4,3.545 | smd 0.275 x 1.15: A5 -1.25,3.545; A6 -0.25,3.545; A7 0.25,3.545; A8 1.25,3.545; B5 1.75,3.545; B6 0.75,3.545; B7 -0.75,3.545; B8 -1.75,3.545 | drill 0.6 pad 1 long: M1 -4.32,2.97; M2 4.32,2.97; M3 -4.32,-1.21; M4 4.32,-1.21 | hole 0.65: 2.89,2.47; -2.89,2.47

### Placement (x,y rotation side)
C1  6.7,27.52 180 top
C2  11.38,24.85 90 top
C3  37.02,2.15 90 top
C4  4.67,5.33 180 top
C5  11.97,1.85 180 top
C6  7.08,4.42 90 top
C7  8.53,3.1 270 top
C8  12.38,19.98 0 top
C9  12.4,18.43 0 top
C10  17.75,27.62 270 top
C11  5.62,3.15 270 top
C13  41.98,2.38 0 top
C14  12.5,17.02 0 top
C15  12.55,15.57 0 top
C16  12.43,21.57 0 top
C18  17.38,24.25 90 top
C19  21.07,14.1 270 top
C20  12.55,14 0 top
D1  16.55,5.12 90 top
D2  17.55,19.6 90 top
D3  17.1,15.05 0 top
D4  15,19.6 270 top
H1  40.55,15.6 90 top
IC1  14.55,24.65 270 top
J1  2.33,2.4 0 top
J2  47.73,30.75 0 top
J3  2.25,30.7 0 top
J4  6.5,16.5 270 top
J5  47.7,2.38 0 top
L1  17.1,10.9 270 top
LED1  23.38,12.65 270 top
Q1  28.88,9.68 180 top
Q3  13.12,9.95 90 top
R1  30.4,1.3 180 top
R2  30.4,2.92 180 top
R3  28.6,14.55 0 top
R4  27.27,12.93 0 top
R6  10.93,8.18 270 top
R7  10.28,27.52 0 top
R8  13.38,7.3 180 top
R9  29.93,5.6 90 top
R10  3.33,27.52 0 top
R11  15.6,28.82 0 top
R12  32.42,29.23 90 top
R13  25.48,15.68 90 top
R14  22.4,15.68 90 top
R15  23.95,15.68 270 top
R22  25.8,8.43 0 top
R23  21.25,8.45 180 top
SW1  9.22,30.95 180 top
SW2  16.32,31.27 180 top
U1  11.43,4.75 180 top
U2  24.52,25.2 180 top
U4  33.88,2.08 0 top
U$2  38.42,29.4 180 bottom
X4  23.4,2.92 0 top

### Tracks (layer width: path | path; a pad name or v marks a point on that pad's centre or on a via)
BUSY  (via drill 0.1)
  Top 0.254: J4.16 v7.1,14.75
  Route3 0.254: U2.21 arc45 19.72,23.22 19.57,23.07 arc45 19.38,22.59 19.38,22.52 arc-45 19.07,21.8 18.66,21.39 arc-45 18.02,21.12 17.88,21.12 arc45 16.17,20.42 14.74,18.99 arc-45 13.49,18.48 7.72,18.48 arc45 6.28,17.88 arc45 5.58,16.18 5.58,15.88 arc45 5.89,15.11 6.03,14.97 arc45 6.57,14.75 v7.1,14.75
  other vias: 20.4,23.5
CIPO  (via drill 0.1)
  other vias: 28.65,24.5
COPI  (via drill 0.1)
  Top 0.254: J4.11 v7.83,17.25
  Route14 0.254: U2.35 27.27,25.25 26.19,24.17 arc45 25.45,22.37 25.45,21.65 arc-45 24.9,20.33 24.9,20.32 arc-45 24.42,20.12 23.13,20.12 arc45 21.33,19.38 18.97,17.02 arc-45 17.17,16.27 15.7,16.27 arc-45 14.97,16.57 14.76,16.79 arc45 13.65,17.25 v7.83,17.25
  other vias: 27.27,25.35
D+  (via drill 0.1)
  Top 0.254: v23.15,7.5 X4.A6 23.15,5.94 arc45 23.27,5.65 arc45 23.62,5.5 arc45 24.08,5.69 arc45 24.15,5.87 X4.B6
  Route2 0.254: v23.15,7.5 23.15,8.08 arc-45 23.45,8.8 26.78,12.13 arc45 27.52,13.93 U2.54
  other vias: 27.52,18.35
D-  (via drill 0.1)
  Top 0.254: X4.B7 22.65,7.48 arc-45 22.82,7.9 arc-45 23.97,8.38 v24,8.38 24,7.87 arc-45 23.7,7.15 arc45 23.65,7.03 X4.A7
  Route2 0.254: v24,8.38 27.78,12.16 arc45 28.52,13.95 U2.55
  other vias: 28.52,18.35
DC  (via drill 0.1)
  Top 0.254: J4.14 v7.08,15.75
  Route2 0.254: v7.08,15.75 10.3,15.75 arc45 15.72,17.99 17.27,19.55 arc-45 18.48,20.05 19.77,20.05 arc45 20.29,20.26 20.54,20.51 arc45 21.05,21.75 21.05,22.34 arc-45 21.25,22.82 21.43,23.01 arc-45 U2.40
  other vias: 21.77,23.15
E_PWR  (via drill 0.1)
  Top 0.2: IC1.1 15.51,26.89 arc45 v15.53,26.93
  Route15 0.254: v15.53,26.93 16,26.93 arc-45 17.45,26.32 17.58,26.19 arc-45 18.32,24.4 18.32,23.98 arc45 18.95,22.48 19.28,22.14 arc45 20.35,21.7 20.93,21.7 arc45 U2.41
  other vias: 21.77,22.05
GDR
  Top 0.254: J4.23 10.22,11.25 arc-45 11.55,10.7 11.86,10.39 arc-45 Q3.1 arc-45 12.29,8.82 R6.1
GND  (via drill 0.1)
  Top 0.152: U2.EAGP2 arc-45 18.51,30.19 18.45,30.25 arc-45 SW2.1 18.06,31.31 arc-45 19.85,32.05 U2.EAGP4
  Top 0.254: U2.EAGP3 31.46,32.05 arc-45 v31.7,31.95 31.7,31.08 arc-45 31.15,29.75 arc-45 30.55,29.5 U2.EAGP1
  other vias: 10.82,21.52 11.78,11.35
  pour Bottom: 0.25,2.25 0.25,8.75 2.25,10.75 2.25,22.25 0.25,24.25 0.25,30.75 arc-90 2.25,32.75 19.5,32.75 19.5,29 29.5,29 29.5,32.75 47.75,32.75 arc-90 49.75,30.75 49.75,2.25 arc-90 47.75,0.25 2.25,0.25 arc-90
  pour Top: 2.25,0.25 47.75,0.25 arc90 49.75,2.25 49.75,30.75 arc90 47.75,32.75 29.5,32.75 29.5,29 19.5,29 19.5,32.75 2.25,32.75 arc90 0.25,30.75 0.25,24.25 2.25,22.25 2.25,10.75 0.25,8.75 0.25,2.25 arc90
LB  (via drill 0.1)
  Top 0.254: R14.2 arc-45 22.38,16.39 v22.38,17.05
  Route15 0.254: v22.38,17.05 arc45 22.88,18.26 U2.43
  other vias: 22.88,20.95
LG  (via drill 0.1)
  Top 0.254: R13.2 v25.48,17.05
  Route15 0.254: 25.49,17.09 arc45 v25.48,17.05 26.54,18.11 arc45 26.75,18.62 arc-45 26.98,19.18 28.27,20.48 arc45 28.65,21.38 U2.4
  other vias: 28.65,22.5
LR  (via drill 0.1)
  Top 0.254: R15.1 23.95,17.02 v23.93,17.05
  Route15 0.254: v23.93,17.05 arc-45 24.26,17.86 25.26,18.86 arc45 26,20.65 26,21.27 arc-45 26.65,22.85 26.75,22.95 arc-45 28.08,23.5 U2.5
  other vias: 28.65,23.5
N$1
  Top 0.254: LED1.4 arc-45 22.71,12.36 arc-45 22.4,13.1 R14.1
N$2
  Top 0.254: LED1.3 arc45 24.59,12.59 24.77,12.78 arc45 25.48,14.46 R13.1
N$3
  Top 0.254: LED1.2 arc-45 23.82,13.05 23.95,13.18 R15.2
N$4
  Top 0.254: SW1.1 11.47,28.85 arc-45 R7.2
N$5
  Top 0.254: C1.1 arc45 7.72,26.63 7.85,26.5 arc45 8.33,26.3 8.78,26.3 arc-45 9.16,26.14 9.22,26.07 arc-45 9.35,25.77 J4.1
N$6
  Top 0.254: C19.1 arc45 20.88,15.22 19.02,17.08 arc-45 18.77,17.68 18.77,18.37 arc45 18.52,18.98 18.17,19.33 arc-45 17.55,20.82 D2.2 D4.1
N$7
  Top 0.254: R22.1 X4.B5
N$8  (via drill 0.1)
  Top 0.254: J4.3 v8.28,21.25 | C2.1 v11.38,23.07
  Route2 0.254: v11.38,23.07 10.29,21.99 arc-45 8.5,21.25 v8.28,21.25
N$9
  Top 0.254: R23.1 arc-45 22.15,7.85 X4.A5
N$10
  Top 0.508: C5.1 arc45 12.61,1.89 U1.1 15.99,3.8 | D1.1 arc45 16.13,3.8 15.99,3.8 | 15.99,3.8 arc-45 14.64,4.36 14.47,4.53 arc-45 14.03,5.61 R8.1
N$11
  Top 0.254: D3.2 19.13,14.77 | 19.13,14.77 arc-45 19.88,12.97 19.88,11.7 arc-45 19.13,9.91 18.75,9.53 arc-45 17.81,9.13 L1.2 arc-45 15.72,9.71 15.17,10.26 arc45 13.37,11 Q3.3 | C19.2 arc-45 20.01,13.89 19.13,14.77
N$12
  Top 0.254: J4.5 11.06,20.25 arc-45 C8.1
N$13
  Top 0.254: SW1.3 5.44,28.9 arc45 4.35,28.45 arc45 3.98,27.55 R10.2
N$14
  Top 0.254: J4.7 9.87,19.25 arc-45 11.67,18.51 C9.1
N$15
  Top 0.254: J4.20 9.73,12.75 arc45 10.28,12.97 10.36,13.06 arc45 10.8,14.12 10.8,14.61 arc-45 11.07,15.28 arc-45 11.8,15.57 C15.1
N$29
  Top 0.254: J4.21 9.87,12.25 arc45 10.65,12.57 11.78,13.7 arc45 C20.1
P0.18/RESET  (via drill 0.1)
  Top 0.254: U2.19 19.52,25.5 arc-45 19.1,25.67 19.05,25.73 arc-45 18.73,26.51 18.73,27.53 arc45 18.55,27.95 arc45 17.77,28.27 C10.1 arc45 16.42,28.82 R11.2 16.25,29.83 arc45 15.95,30.55 15.65,30.85 arc45 SW2.2
  Route15 0.305: v40.95,28.15 39.74,26.94 arc-45 37.95,26.2 22.09,26.2 arc45 U2.19
  Bottom 0.305: U$2.6 v40.95,28.15
  other vias: 20.4,25.5
PEN
  Top 0.508: U1.3 arc45 12.72,5.98 R8.2
PREVGH  (via drill 0.11)
  Top 0.254: C16.1 11.69,21.49 arc-45 9.9,20.75 J4.4 7.51,20.75 arc45 6,20.12 5.72,19.84 arc45 4.97,18.05 4.97,15.04 arc45 5.71,13.26 arc45 v7.85,12.38 | D3.1 15.35,14.46 arc-45 v15.2,14.1
  Route2 0.254: v15.2,14.1 arc-45 13.45,13.38 9.9,13.38 arc45 8.11,12.63 v7.85,12.38
PREVGL
  Top 0.254: D4.2 15,18.75 arc45 14.57,19.77 arc-45 14,21.16 14,21.61 arc45 13.78,22.15 13.72,22.2 arc45 13.12,22.45 11.43,22.45 arc45 10.83,22.2 10.72,22.1 arc-45 9.88,21.75 J4.2
PS  (via drill 0.1)
  Top 0.254: J4.13 v7.83,16.25
  Route2 0.254: v7.83,16.25 6.92,16.25 arc45 6.2,15.95 5.99,15.74 arc45 5.85,15.4 5.85,15.09 arc45 6.17,14.3 arc45 6.9,14 11.97,14 arc45 13.77,14.74 16.43,17.41 arc-45 18.23,18.15 19.82,18.15 arc45 20.93,18.61 21.93,19.6 arc45 22.1,20.02 22.1,20.78 arc-45 22.45,21.62 22.66,21.84 arc45 23,22.65 23,23.54 arc45 22.85,23.9 arc45 22,24.25 U2.39
  other vias: 21.77,24.25
RES  (via drill 0.1)
  Top 0.254: J4.15 v7.83,15.25
  Route3 0.254: U2.22 arc-45 20.1,21.77 19.13,20.8 arc-45 18.4,20.5 17.93,20.5 arc45 16.52,19.92 12.59,15.99 arc-45 10.8,15.25 v7.83,15.25
  other vias: 20.4,22.5
RESE  (via drill 0.1)
  Top 0.254: Q3.2 13.12,9.55 arc-45 12.45,11.18 12.45,11.28 arc45 12.21,11.87 12.07,12 arc45 11.71,12.15 11.33,12.15 arc45 10.85,11.95 arc-45 10.37,11.75 J4.22 v8.3,11.75 | SW1.2 v9.25,28.9
  Route15 0.254: v9.25,28.9 9.25,28.2 arc-45 8.95,27.48 7.47,25.99 arc-45 7,25.8 6.88,25.8 arc45 5.08,25.06 4.59,24.57 arc45 3.85,22.77 3.85,14.15 arc45 4.49,12.61 5.05,12.05 arc45 5.77,11.75 v8.3,11.75
SCK  (via drill 0.1)
  Top 0.254: J4.12 v7.1,16.75
  Route14 0.254: U2.1 24.1,19.5 arc45 22.31,18.76 19.12,15.57 arc-45 17.32,14.82 14.1,14.82 arc-45 12.31,15.57 11.85,16.02 arc45 10.1,16.75 v7.1,16.75
  other vias: 28.65,19.5
SCL  (via drill 0.1)
  Top 0.254: U4.2 33.1,1.68 arc45 v32.2,1.3 R1.1
  Route3 0.254: U2.18 27.5,26.5 arc-45 29.29,25.76 32.93,22.12 arc-45 33.67,20.32 33.67,3.67 arc-45 33.04,2.14 v32.2,1.3
  other vias: 20.4,26.5
SDA  (via drill 0.1)
  Top 0.254: R2.1 arc-45 31.11,2.95 v32.17,2.95 32.28,2.85 arc45 U4.1
  Route3 0.254: U2.20 20.46,24.57 arc-45 21.57,25.02 23.75,25.02 arc-45 25.54,24.28 31.43,18.39 arc-45 32.17,16.6 v32.17,2.95
  other vias: 20.4,24.5
SWDCLK  (via drill 0.1)
  Top 0.254: R12.2 v32.42,30.82
  Top 0.305: v32.42,30.82 32.61,31.01 arc-45 34.4,31.75 36.3,31.75 arc-45 38.09,31.01 v38.42,30.68
  Route14 0.305: U2.11 29.35,28.43 arc45 31.14,29.17 32.16,30.18 arc45 v32.42,30.82
  Bottom 0.305: U$2.3 arc-45 v38.42,30.68
  other vias: 26.52,28.43
SWDIO  (via drill 0.1)
  Route14 0.305: U2.15 22.88,28.07 arc45 26.73,26.48 33.17,26.48 arc45 34.97,27.22 v35.88,28.12
  Bottom 0.305: U$2.2 U$2.2 arc-45 v35.88,28.12
  other vias: 22.52,28.43
V_LEV  (via drill 0.1)
  Top 0.254: R4.2 27.93,14.49 arc-45 R3.1 v26.73,14.55
  Route15 0.254: U2.25 20.4,18 arc45 21.14,16.21 22.06,15.29 arc45 23.85,14.55 v26.73,14.55
  other vias: 20.4,19.5
VBAT  (via drill 0.1)
  Top 0.254: 32.71,8.79 32.22,9.28 arc-45 31.48,11.08 31.48,12.1 arc45 30.73,13.89 30.65,13.97 arc45 29.26,14.55 R3.2
  Top 0.305: C13.1 arc45 40.55,2.46 H1.1
  Top 0.508: Q1.3 30.77,9.68 arc-45 32.57,8.93 32.71,8.79 35.66,5.84 arc45 37.45,5.1 H1.1
  Bottom 0.508: H1.2 H1.1
  other vias: 40.55,26.1 40.55,5.1
VBUS  (via drill 0.1)
  Top 0.254: R9.2 v29.93,7.6
  Top 0.508: X4.A4B9 v21,7.45 | X4.B4A9 v25.8,7.45 | v17.98,8.1 v17.97,8.1 17.8,8.1 arc45 16.73,7.65 arc45 16.55,7.23 D1.2 | Q1.1 v29.93,7.6
  Route3 0.305: U2.31 arc45 26.85,20.77 26.73,20.65 arc45 26.57,20.29 26.57,16.97 arc-45 26.27,16.25 arc45 25.8,15.1 v25.8,7.45
  Bottom 0.508: v17.98,8.1 19.43,8.1 arc-45 v21,7.45 21.31,7.14 arc45 23.1,6.4 23.82,6.4 arc45 25.4,7.05 v25.8,7.45 arc-45 26.64,7.8 29.44,7.8 arc-45 v29.93,7.6
  other vias: 27.27,20.95
VCC  (via drill 0.1, 0.15)
  Top 0.254: LED1.1 v22.98,13.85 | v12.43,26.95 arc-45 12.81,27.89 13.01,28.08 arc-45 14.8,28.82 R11.1 | R12.1 31.86,28.01 arc-45 v30.62,27.5 | R1.2 R2.2 arc-45 30.05,3.65 30.25,3.85 arc-45 v30.98,4.15 | C3.1 v35.62,1.5 35,1.5 arc-45 U4.3
  Top 0.305: U2.10 U2.9 v30.62,27.5
  Top 0.508: C7.1 10.07,3.73 arc45 U1.5 | C7.1 7.1,3.75 C6.1 7.05,3.8 C11.1 | C11.1 5.4,3.8 | C7.1 8.5,3.77 v8.5,5.08 | Q1.2 v29.93,11.78 | IC1.2 12.43,26.86 v12.43,26.95 | 5.33,5.28 C4.1 arc-45 5.62,4.6 C11.1
  Bottom 0.254: v22.98,13.85 21.68,12.55 arc-45 19.8,11.78 | v29.93,11.78 30.05,11.78 arc-45 31.8,11.05 arc-45 32.48,9.42 32.48,6.7 | 32.48,6.7 32.48,5.7 arc45 33.22,3.91 v35.62,1.5 | 32.48,6.7 arc-45 31.73,4.91 v30.98,4.15
  Bottom 0.305: U$2.1 v35.88,30.68
  Bottom 0.508: v8.5,5.08 11.38,7.96 arc45 12.38,10.35 12.43,10.4 | v29.93,11.78 19.8,11.78 14.85,11.78 arc45 13.05,11.03 12.43,10.4 | 12.43,10.4 12.43,19.65 | 12.43,19.65 v12.43,26.95 | 12.43,19.65 arc-45 13.17,21.44 18.48,26.76 arc-45 20.28,27.5 v30.62,27.5 31.66,27.5 arc45 33.46,28.24 U$2.1
VCC_1  (via drill 0.1)
  Top 0.254: C14.1 arc45 10.1,17.75 J4.10 J4.9 8.98,18.25 arc45 v8.2,17.93 | L1.1 15.8,12.66 arc-45 v14.88,13.05 | C18.1 IC1.3 arc-45 14.43,23.55 v13.62,23.55
  Route14 0.254: v14.88,13.05 8.1,13.05 arc-45 6.31,13.79 6.15,13.95 arc-45 5.5,15.52 5.5,16.52 arc-45 5.76,17.16 6.1,17.5 arc-45 7.13,17.93 v8.2,17.93 arc-45 8.34,18.27 v13.62,23.55

### Text on the board
Bottom: Valetudo / v3.0 / by Tanmoy